# EAGLE design main_board (EAGLE 8.3.0)
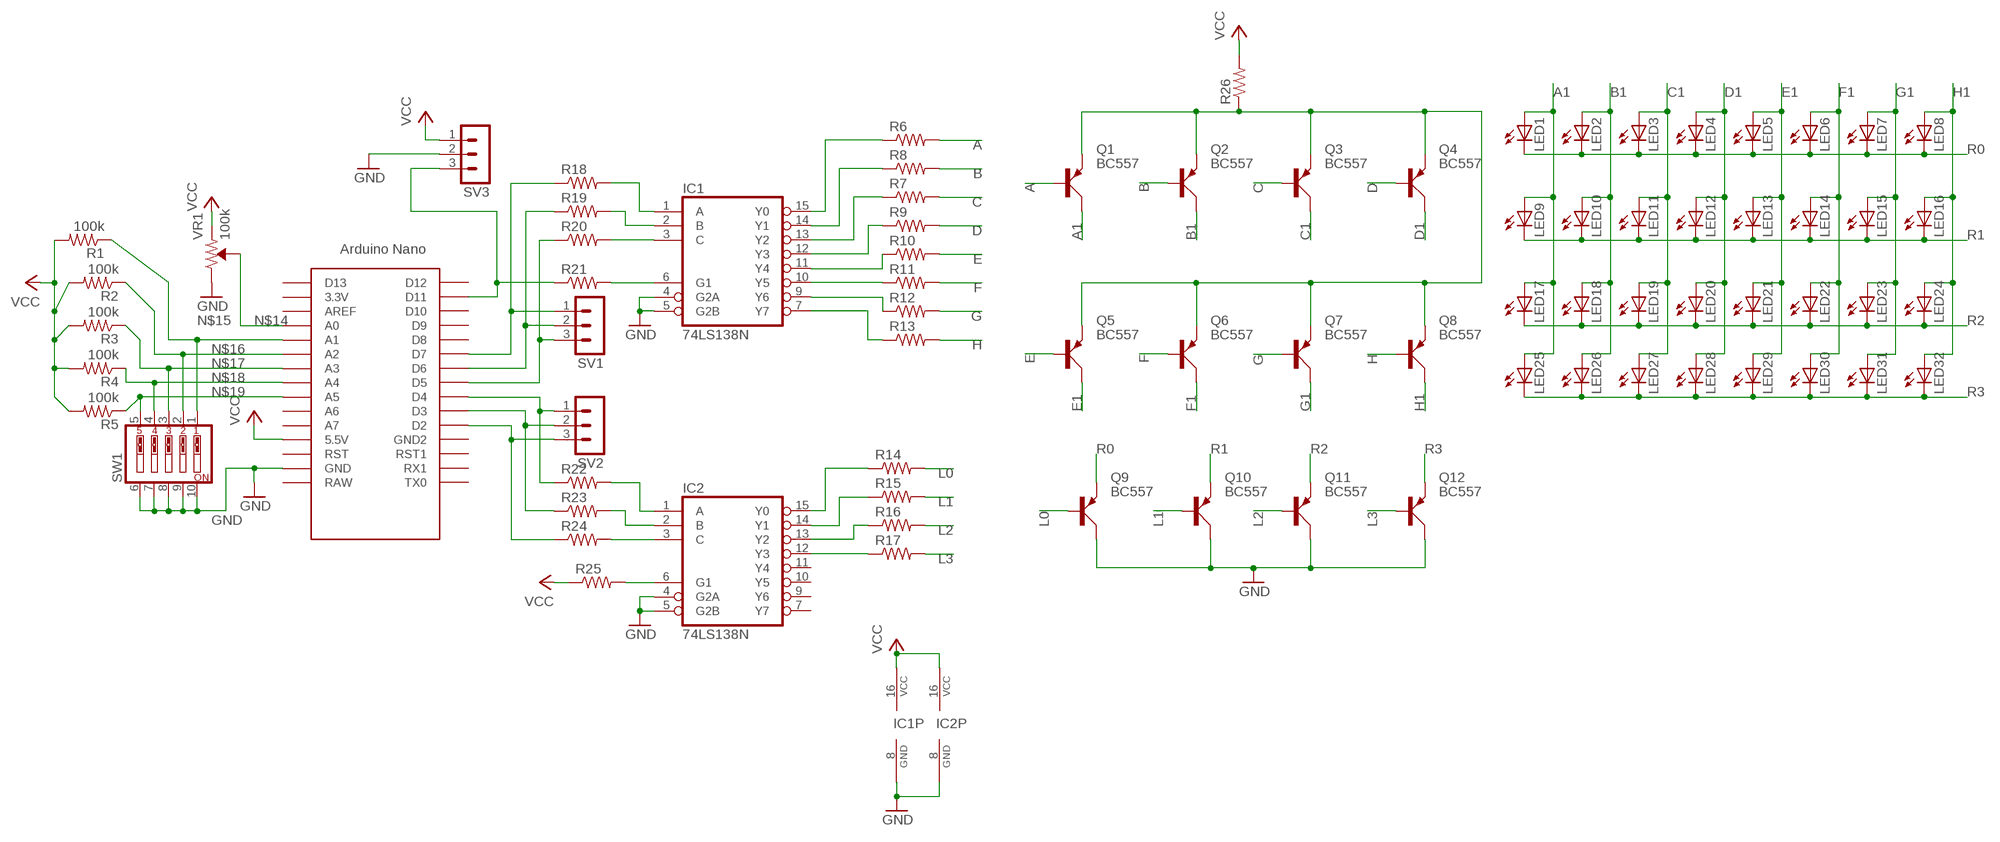
[diagram p0: schematic, sheet 1]

## Parts
ARD1  NANO  [NANO]
IC1  74LS138N  [DIL16]
IC2  74LS138N  [DIL16]
LED1  LED5MM  [LED5MM]
LED2  LED5MM  [LED5MM]
LED3  LED5MM  [LED5MM]
LED4  LED5MM  [LED5MM]
LED5  LED5MM  [LED5MM]
LED6  LED5MM  [LED5MM]
LED7  LED5MM  [LED5MM]
LED8  LED5MM  [LED5MM]
LED9  LED5MM  [LED5MM]
LED10  LED5MM  [LED5MM]
LED11  LED5MM  [LED5MM]
LED12  LED5MM  [LED5MM]
LED13  LED5MM  [LED5MM]
LED14  LED5MM  [LED5MM]
LED15  LED5MM  [LED5MM]
LED16  LED5MM  [LED5MM]
LED17  LED5MM  [LED5MM]
LED18  LED5MM  [LED5MM]
LED19  LED5MM  [LED5MM]
LED20  LED5MM  [LED5MM]
LED21  LED5MM  [LED5MM]
LED22  LED5MM  [LED5MM]
LED23  LED5MM  [LED5MM]
LED24  LED5MM  [LED5MM]
LED25  LED5MM  [LED5MM]
LED26  LED5MM  [LED5MM]
LED27  LED5MM  [LED5MM]
LED28  LED5MM  [LED5MM]
LED29  LED5MM  [LED5MM]
LED30  LED5MM  [LED5MM]
LED31  LED5MM  [LED5MM]
LED32  LED5MM  [LED5MM]
Q1  BC557  [SOT54A]
Q2  BC557  [SOT54A]
Q3  BC557  [SOT54A]
Q4  BC557  [SOT54A]
Q5  BC557  [SOT54A]
Q6  BC557  [SOT54A]
Q7  BC557  [SOT54A]
Q8  BC557  [SOT54A]
Q9  BC557  [SOT54A]
Q10  BC557  [SOT54A]
Q11  BC557  [SOT54A]
Q12  BC557  [SOT54A]
R1  100k  R-US_M0805  [M0805]
R2  100k  R-US_M0805  [M0805]
R3  100k  R-US_M0805  [M0805]
R4  100k  R-US_M0805  [M0805]
R5  100k  R-US_M0805  [M0805]
R6  R-US_R0805  [R0805]
R7  R-US_R0805  [R0805]
R8  R-US_R0805  [R0805]
R9  R-US_R0805  [R0805]
R10  R-US_R0805  [R0805]
R11  R-US_R0805  [R0805]
R12  R-US_R0805  [R0805]
R13  R-US_R0805  [R0805]
R14  R-US_R0805  [R0805]
R15  R-US_R0805  [R0805]
R16  R-US_R0805  [R0805]
R17  R-US_R0805  [R0805]
R18  R-US_M0805  [M0805]
R19  R-US_M0805  [M0805]
R20  R-US_M0805  [M0805]
R21  R-US_M0805  [M0805]
R22  R-US_M0805  [M0805]
R23  R-US_M0805  [M0805]
R24  R-US_M0805  [M0805]
R25  R-US_M0805  [M0805]
R26  R-US_R0805  [R0805]
SV1  MA03-1  [MA03-1]
SV2  MA03-1  [MA03-1]
SV3  MA03-1  [MA03-1]
SW1  SW_DIP-5  [EDG-05]
VR1  100k  TRIMPOT-PTH-10MM-KNOB-1/2W-10%  [TRIMPOT-PTH-3386U]

## Nets
A: Q1.B R6.2
A1: LED1.A LED9.A LED17.A LED25.A Q1.C
B: Q2.B R8.2
B1: LED2.A LED10.A LED18.A LED26.A Q2.C
C: Q3.B R7.2
C1: LED3.A LED11.A LED19.A LED27.A Q3.C
D: Q4.B R9.2
D1: LED4.A LED12.A LED20.A LED28.A Q4.C
E: Q5.B R10.2
E1: LED5.A LED13.A LED21.A LED29.A Q5.C
F: Q6.B R11.2
F1: LED6.A LED14.A LED22.A LED30.A Q6.C
G: Q7.B R12.2
G1: LED7.A LED15.A LED23.A LED31.A Q7.C
GND: ARD1.GND IC1.4(G2A) IC1.5(G2B) IC1.8(GND) IC2.4(G2A) IC2.5(G2B) IC2.8(GND) Q9.C Q10.C Q11.C Q12.C SV3.2 SW1.6 SW1.7 SW1.8 SW1.9 SW1.10 VR1.3(CW)
H: Q8.B R13.2
H1: LED8.A LED16.A LED24.A LED32.A Q8.C
L0: Q9.B R14.2
L1: Q10.B R15.2
L2: Q11.B R16.2
L3: Q12.B R17.2
N$1: IC2.12(Y3) R17.1
N$2: IC1.15(Y0) R6.1
N$4: IC1.14(Y1) R8.1
N$5: IC2.13(Y2) R16.1
N$6: IC1.13(Y2) R7.1
N$7: IC1.12(Y3) R9.1
N$8: IC1.11(Y4) R10.1
N$9: IC1.10(Y5) R11.1
N$10: IC1.9(Y6) R12.1
N$11: IC1.7(Y7) R13.1
N$12: IC2.14(Y1) R15.1
N$13: IC2.15(Y0) R14.1
N$14: ARD1.A0 VR1.2(WIPER)
N$15: ARD1.A1 R1.1 SW1.1
N$16: ARD1.A2 R2.1 SW1.2
N$17: ARD1.A3 R3.1 SW1.3
N$18: ARD1.A4 R4.1 SW1.4
N$19: ARD1.A5 R5.1 SW1.5
N$20: Q1.E Q2.E Q3.E Q4.E Q5.E Q6.E Q7.E Q8.E R26.1
N$22: ARD1.D2 R24.1 SV2.3
N$23: ARD1.D3 R23.1 SV2.2
N$24: ARD1.D4 R22.1 SV2.1
N$25: ARD1.D5 R20.1 SV1.3
N$26: ARD1.D6 R19.1 SV1.2
N$27: ARD1.D7 R18.1 SV1.1
N$31: ARD1.D11 R21.1 SV3.3
N$38: IC2.3(C) R24.2
N$39: IC2.2(B) R23.2
N$40: IC2.1(A) R22.2
N$41: IC1.3(C) R20.2
N$42: IC1.2(B) R19.2
N$43: IC1.1(A) R18.2
N$45: IC1.6(G1) R21.2
N$48: IC2.6(G1) R25.2
R0: LED1.K(C) LED2.K(C) LED3.K(C) LED4.K(C) LED5.K(C) LED6.K(C) LED7.K(C) LED8.K(C) Q9.E
R1: LED9.K(C) LED10.K(C) LED11.K(C) LED12.K(C) LED13.K(C) LED14.K(C) LED15.K(C) LED16.K(C) Q10.E
R2: LED17.K(C) LED18.K(C) LED19.K(C) LED20.K(C) LED21.K(C) LED22.K(C) LED23.K(C) LED24.K(C) Q11.E
R3: LED25.K(C) LED26.K(C) LED27.K(C) LED28.K(C) LED29.K(C) LED30.K(C) LED31.K(C) LED32.K(C) Q12.E
VCC: ARD1.5V(5.5V) IC1.16(VCC) IC2.16(VCC) R1.2 R2.2 R3.2 R4.2 R5.2 R25.1 R26.2 SV3.1 VR1.1(CCW)
Unconnected: ARD1.3.3V ARD1.A6 ARD1.A7 ARD1.AREF ARD1.D8 ARD1.D9 ARD1.D10 ARD1.D12 ARD1.D13 ARD1.GND1(GND2) ARD1.ICSP1 ARD1.ICSP2 ARD1.ICSP3 ARD1.ICSP4 ARD1.ICSP5 ARD1.ICSP6 ARD1.RAW ARD1.RST ARD1.RST1 ARD1.RX1 ARD1.TX0 IC2.7(Y7) IC2.9(Y6) IC2.10(Y5) IC2.11(Y4)

## Library data of the parts
ARD1 = Arduino-clone:NANO: Arduino Nano
IC1 IC2 = 74xx-us:74*138: 3-line to 8-line DECODER/DEMULTIPLEXER
LED1-LED32 = led:LED: LED OSRAM: - CHIPLED LG R971, LG N971, LY N971, LG Q971, LY Q971, LO R971, LY R971 LH N974, LH R974 LS Q976, LO Q976, LY Q976 LO Q996 - Hyper CHIPLED LW Q18S LB Q993, LB Q99A, LB R99A - SideLED LS A670, LO A670, LY A670, LG A670, LP A670 LB A673, LV A673, LT A673, LW A673 LH A674 LY A675 LS A676, LA A676, LO A676, LY A676, LW A676 LS A679, LY A679, LG A679 - Hyper Micro SIDELED® LS Y876, LA Y876, LO Y876, LY Y876 LT Y87S - SmartLED LW L88C, LW L88S LB L89C, LB L89S, LG L890 LS L89K, LO L89K, LY L89K LS L896, LA L896, LO L896, LY L896 - TOPLED LS T670, LO T670, LY T670, LG T670, LP T670 LSG T670, LSP T670, LSY T670, LOP T670, LYG T670 LG T671, LOG T671, LSG T671 LB T673, LV T673, LT T673, LW T673 LH T674 LS T676, LA T676, LO T676, LY T676, LB T676, LH T676, LSB T676, LW T676 LB T67C, LV T67C, LT T67C, LS T67K, LO T67K, LY T67K, LW E67C LS E67B, LA E67B, LO E67B, LY E67B, LB E67C, LV E67C, LT E67C LW T67C LS T679, LY T679, LG T679 LS T770, LO T770, LY T770, LG T770, LP T770 LB T773, LV T773, LT T773, LW T773 LH T774 LS E675, LA E675, LY E675, LS T675 LS T776, LA T776, LO T776, LY T776, LB T776 LHGB T686 LT T68C, LB T68C - Hyper Mini TOPLED® LB M676 - Mini TOPLED Santana® LG M470 LS M47K, LO M47K, LY M47K Source: http://www.osram.convergy.de LUXEON: - LUMILED® LXK2-PW12-R00, LXK2-PW12-S00, LXK2-PW14-U00, LXK2-PW14-V00 LXK2-PM12-R00, LXK2-PM12-S00, LXK2-PM14-U00 LXK2-PE12-Q00, LXK2-PE12-R00, LXK2-PE12-S00, LXK2-PE14-T00, LXK2-PE14-U00 LXK2-PB12-K00, LXK2-PB12-L00, LXK2-PB12-M00, LXK2-PB14-N00, LXK2-PB14-P00, LXK2-PB14-Q00 LXK2-PR12-L00, LXK2-PR12-M00, LXK2-PR14-Q00, LXK2-PR14-R00 LXK2-PD12-Q00, LXK2-PD12-R00, LXK2-PD12-S00 LXK2-PH12-R00, LXK2-PH12-S00 LXK2-PL12-P00, LXK2-PL12-Q00, LXK2-PL12-R00 Source: www.luxeon.com KINGBRIGHT: KA-3528ASYC Source: www.kingbright.com
Q1-Q12 = transistor-small-signal:BC557: PNP TRANSISTOR
R1-R5 R18-R25 = resistor:R-US_: RESISTOR, American symbol
R6-R17 R26 = rcl:R-US_: RESISTOR, American symbol
SV1-SV3 = con-lstb:MA03-1: PIN HEADER; OC_FARNELL: unknown; OC_NEWARK: unknown
SW1 = special:SW_DIP-5: DIP SWITCH
VR1 = SparkFun-Resistors:TRIMPOT: Trimming Potentiometer (Trimpot) Three-terminal potentiometers, with an adjustable wiper and two adjustable resistors. A pot can be used to create a configurable voltage divider, or as a variable resistor. "Trimpots" are a subset of potentiometers, usually intended for "set-and-forget" applications. They're often more delicate than standard potentiometers - rated for fewer turns. Variants PTH-KNOB - PTH Trimpot w/ finger-adjustable knob Trimpot 10K with Knob <https://www.sparkfun.com/products/9806> (COM-09806) Datasheet <http://www.sparkfun.com/datasheets/Components/General/TSR-3386.pdf> SMD-3MM-CLOSED-FRAME - SMD 3mm Square Closed-Frame Trimpot Used on e.g. EasyDriver - Stepper Motor Driver <https://www.sparkfun.com/products/12779> Datasheet <http://www.bitechnologies.com/pdfs/22.pdf> (22AR10KTR) SMD-5MM - SMD 5mm Square Closed-Frame Trimpot Used on e.g. IOIO-OTG - V2.2 <https://www.sparkfun.com/products/13613> Datasheet <http://www.vishay.com/docs/51008/ts53.pdf> (TS53YL502MR10) SMD-3MM-1/10W-25% - 3mm Square Open-Frame Trimpot Used on e.g. SparkFun Shapeoko <https://www.sparkfun.com/products/13899> Datasheet <http://www.bourns.com/docs/Product-Datasheets/TC33.pdf> (TC33X-2-103E); PROD_ID: RES-09730; SF_SKU: COM-09806; VALUE: 10k

## Board
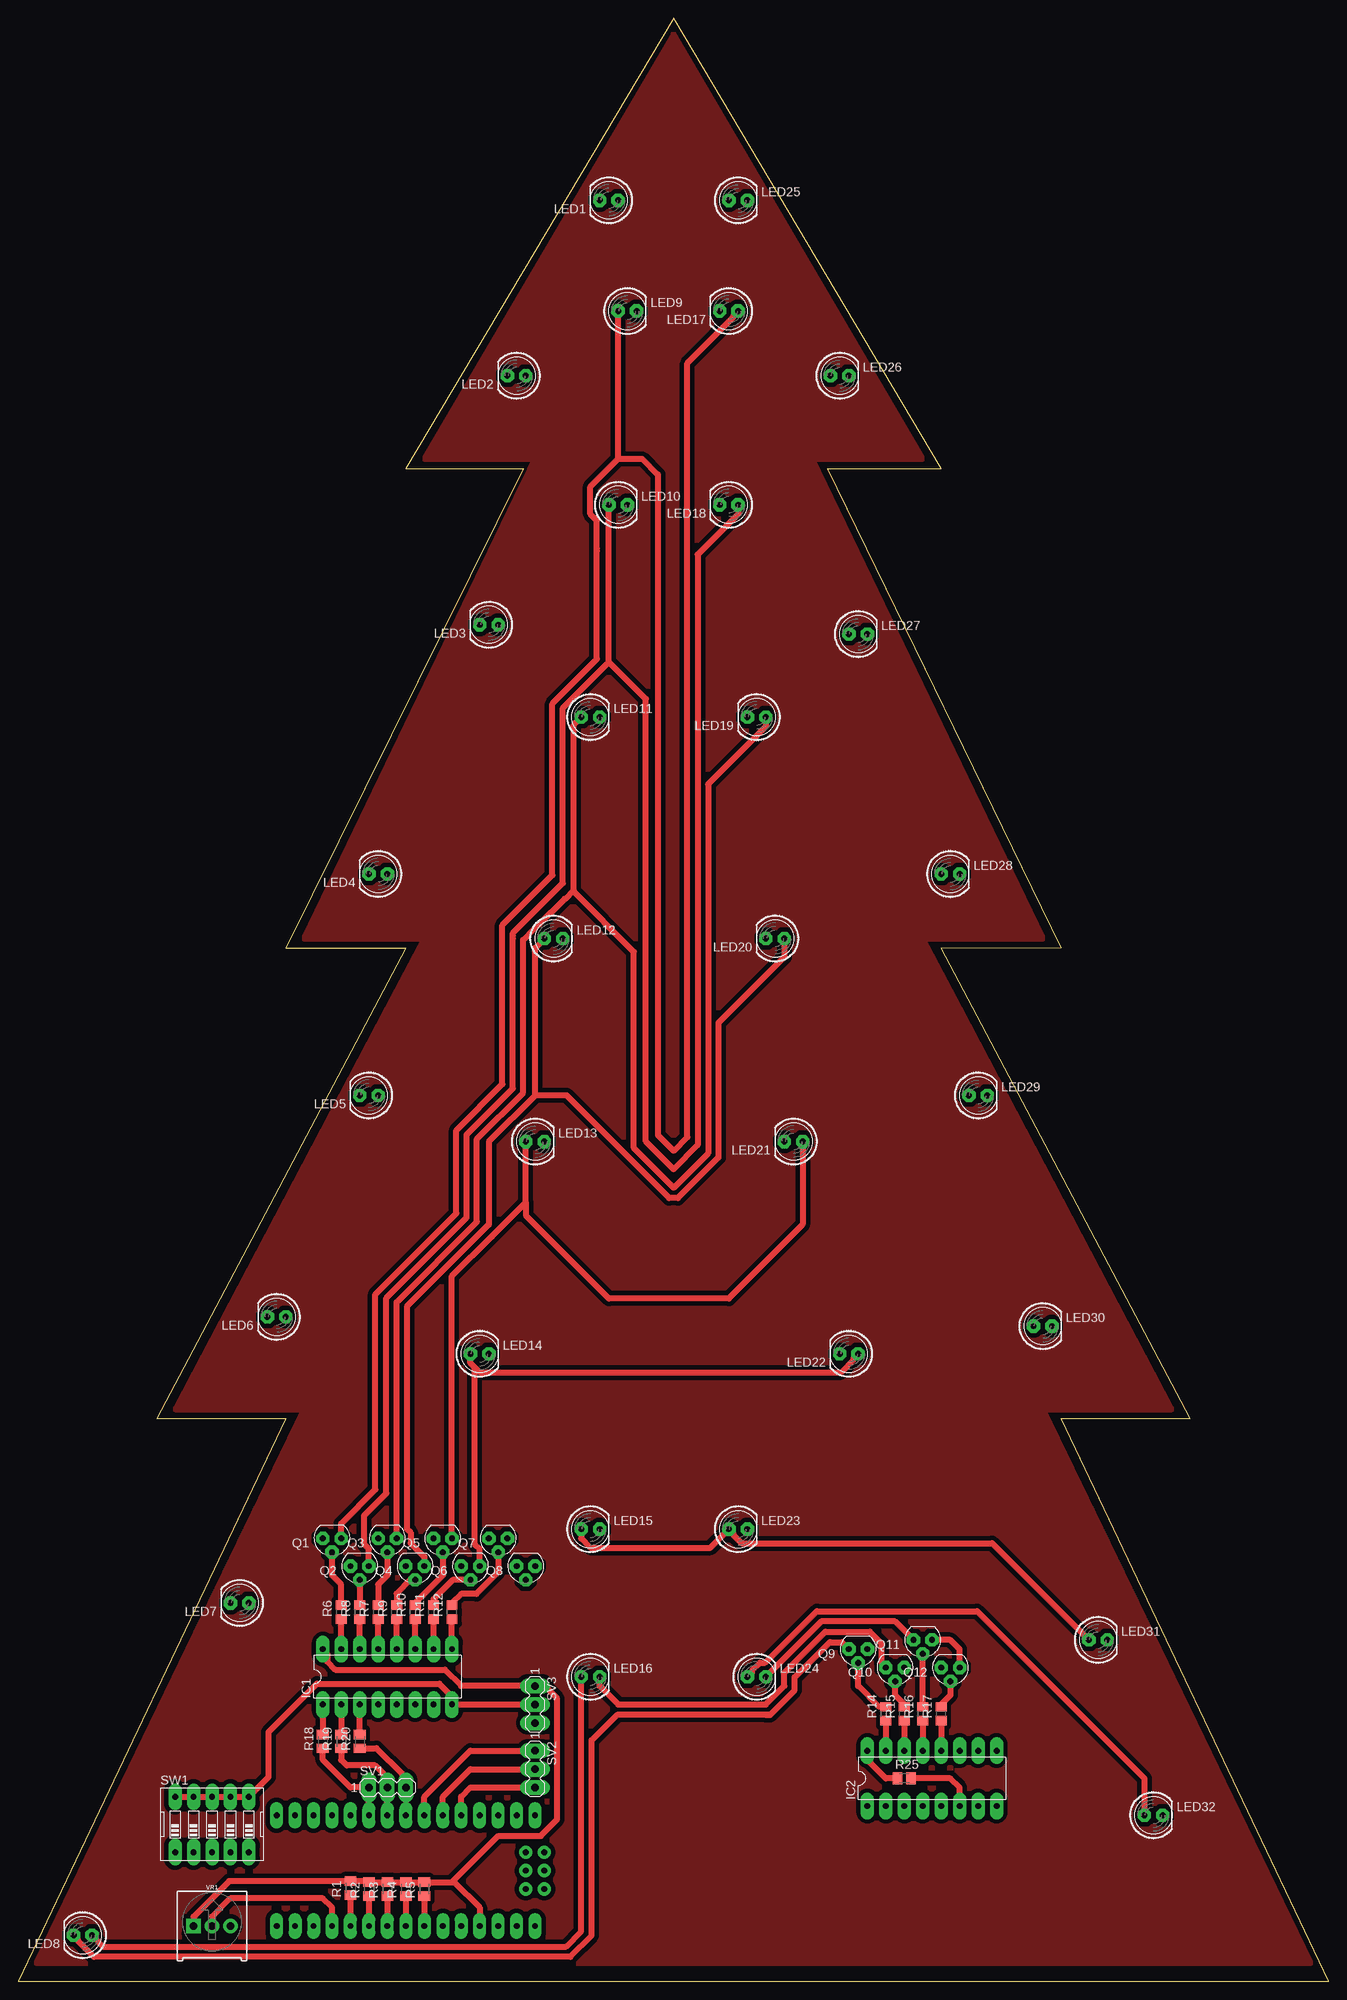
[diagram p1: board, top side]
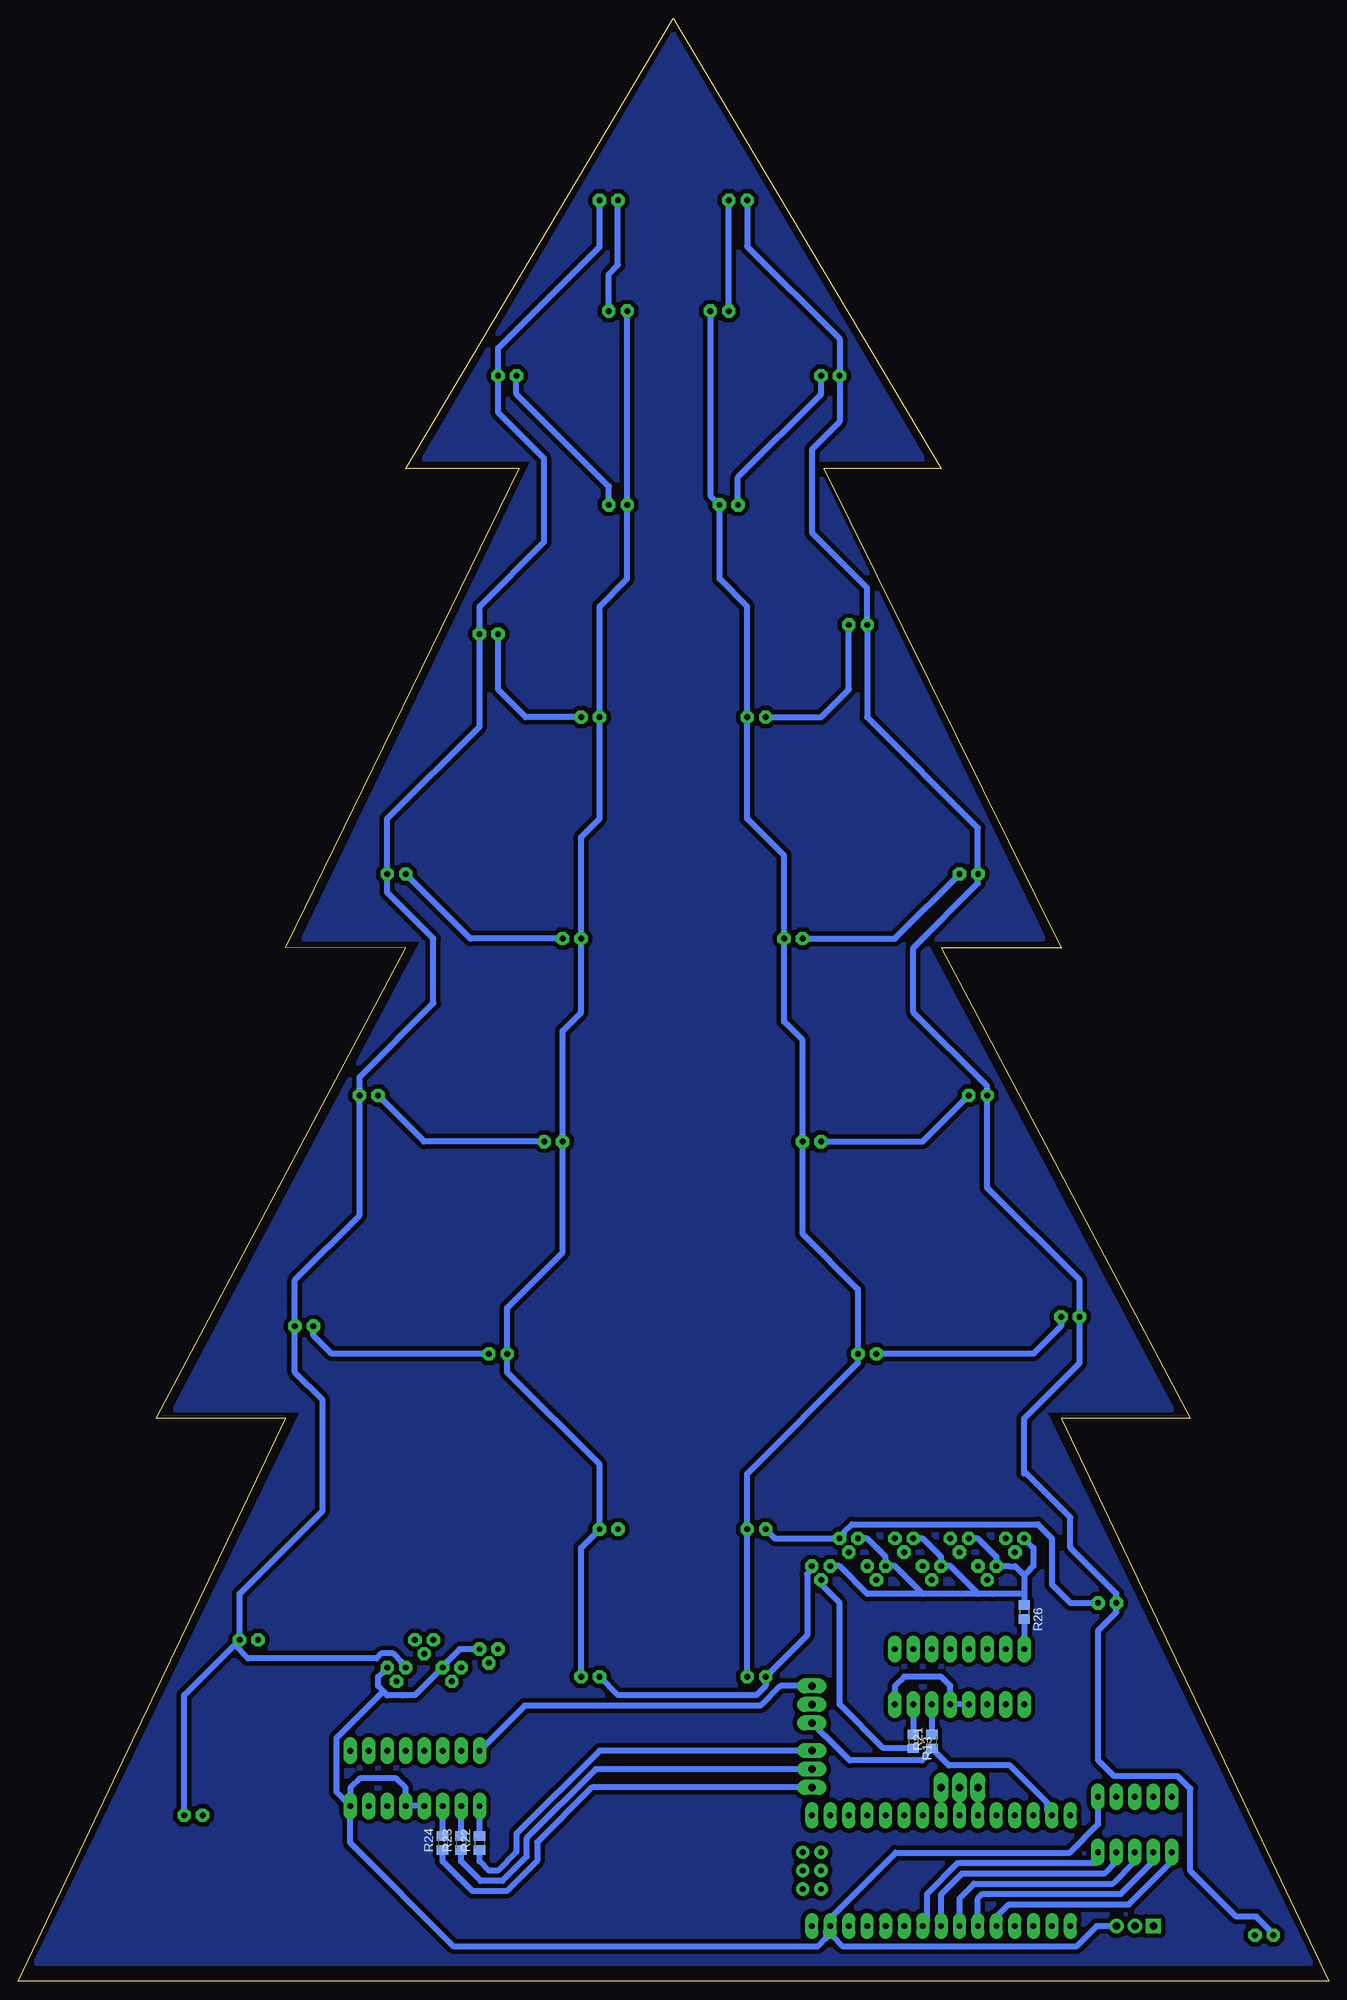
[diagram p2: board, bottom side, seen from below]

Size 180.32 x 270.18 mm. Coordinates in mm from the lower left corner, seen from the top.
Outline: 0,0 180.32,0 143.51,77.47 161.29,77.47 127,142.24 143.49,142.26 111.36,208.2 127,208.15 90.22,270.18 53.34,208.2 69.47,208.15 36.83,142.24 53.34,142.24 19.05,77.47 36.83,77.47 0,0
Copper layers (1*16): Top 0.035mm / dielectric 1.5mm / Bottom 0.035mm
Design rules "LabE *": minimum track width 24mil, minimum drill 1mm, track to track 24mil, track to pad 24mil, pad to pad 16mil, via to via 16mil, smd to smd 8mil, copper to edge 20mil, drill to drill 8mil, minimum pad ring 20mil, minimum via ring 8mil, stop-mask expansion 4mil, vias tented up to drill 0mil, thermal gap 10mil

### Footprints (pad centres in the part's own frame; a part is rotated, then mirrored left to right if it is on the bottom)
NANO = drill 0.8 long: 3.3V -10.16,24.13; 5V -10.16,-1.27; A0 -10.16,19.05; A1 -10.16,16.51; A2 -10.16,13.97; A3 -10.16,11.43; A4 -10.16,8.89; A5 -10.16,6.35; A6 -10.16,3.81; A7 -10.16,1.27; AREF -10.16,21.59; D2 5.08,1.27; D3 5.08,3.81; D4 5.08,6.35; D5 5.08,8.89; D6 5.08,11.43; D7 5.08,13.97; D8 5.08,16.51; D9 5.08,19.05; D10 5.08,21.59; D11 5.08,24.13; D12 5.08,26.67; D13 -10.16,26.67; GND -10.16,-6.35; GND1 5.08,-1.27; RAW -10.16,-8.89; RST -10.16,-3.81; RST1 5.08,-3.81; RX1 5.08,-6.35; TX0 5.08,-8.89 | drill 0.8: ICSP1 -5.08,-10.16; ICSP2 -5.08,-7.62; ICSP3 -2.54,-10.16; ICSP4 -2.54,-7.62; ICSP5 0,-10.16; ICSP6 0,-7.62
DIL16 = drill 0.813 long: 1 -8.89,-3.81; 2 -6.35,-3.81; 3 -3.81,-3.81; 4 -1.27,-3.81; 5 1.27,-3.81; 6 3.81,-3.81; 7 6.35,-3.81; 8 8.89,-3.81; 9 8.89,3.81; 10 6.35,3.81; 11 3.81,3.81; 12 1.27,3.81; 13 -1.27,3.81; 14 -3.81,3.81; 15 -6.35,3.81; 16 -8.89,3.81
LED5MM = drill 0.813 octagon: A -1.27,0; K 1.27,0
SOT54A = drill 0.813 octagon: B 0,1.905; C -1.27,0; E 1.27,0
M0805 = smd 1.3 x 1.6: 1 -0.95,0; 2 0.95,0
R0805 = smd 1.3 x 1.5: 1 -0.95,0; 2 0.95,0
MA03-1 = drill 1.016 long: 1 -2.54,0; 2 0,0; 3 2.54,0
EDG-05 = drill 0.813 long: 1 -5.08,-3.81; 2 -2.54,-3.81; 3 0,-3.81; 4 2.54,-3.81; 5 5.08,-3.81; 6 5.08,3.81; 7 2.54,3.81; 8 0,3.81; 9 -2.54,3.81; 10 -5.08,3.81
TRIMPOT-PTH-3386U = drill 1.016 pad 1.88 square: 1 -2.54,-0.015 | drill 1.016 pad 1.88: 2 0,-0.015; 3 2.54,-0.015

### Placement (x,y rotation side)
ARD1  62.23,17.78 90 top
IC1  50.8,41.91 0 top
IC2  125.73,27.94 0 top
LED1  81.28,245.11 180 top
LED2  68.58,220.98 180 top
LED3  64.77,186.69 180 top
LED4  49.53,152.4 180 top
LED5  48.26,121.92 180 top
LED6  35.56,91.44 180 top
LED7  30.48,52.07 180 top
LED8  8.89,6.35 180 top
LED9  83.82,229.87 0 top
LED10  82.55,203.2 0 top
LED11  78.74,173.99 0 top
LED12  73.66,143.51 0 top
LED13  71.12,115.57 0 top
LED14  63.5,86.36 0 top
LED15  78.74,62.23 0 top
LED16  78.74,41.91 0 top
LED17  97.79,229.87 180 top
LED18  97.79,203.2 180 top
LED19  101.6,173.99 180 top
LED20  104.14,143.51 180 top
LED21  106.68,115.57 180 top
LED22  114.3,86.36 180 top
LED23  99.06,62.23 0 top
LED24  101.6,41.91 0 top
LED25  99.06,245.11 0 top
LED26  113.03,220.98 0 top
LED27  115.57,185.42 0 top
LED28  128.27,152.4 0 top
LED29  132.08,121.92 0 top
LED30  140.97,90.17 0 top
LED31  148.59,46.99 0 top
LED32  156.21,22.86 0 top
Q1  43.18,60.96 180 top
Q2  46.99,57.15 180 top
Q3  50.8,60.96 180 top
Q4  54.61,57.15 180 top
Q5  58.42,60.96 180 top
Q6  62.23,57.15 180 top
Q7  66.04,60.96 180 top
Q8  69.85,57.15 180 top
Q9  115.57,45.72 180 top
Q10  120.65,43.18 180 top
Q11  124.46,46.99 180 top
Q12  128.27,43.18 180 top
R1  45.72,12.83 90 top
R2  48.26,12.7 90 top
R3  50.8,12.7 90 top
R4  53.34,12.7 90 top
R5  55.88,12.7 90 top
R6  44.45,50.8 90 top
R7  49.53,50.8 90 top
R8  46.99,50.8 90 top
R9  52.07,50.8 90 top
R10  54.61,50.8 90 top
R11  57.15,50.8 90 top
R12  59.69,50.8 90 top
R13  57.15,33.02 270 bottom
R14  119.38,36.83 90 top
R15  121.92,36.83 90 top
R16  124.46,36.83 90 top
R17  127,36.83 90 top
R18  41.91,33.02 90 top
R19  44.45,33.02 90 top
R20  46.99,33.02 90 top
R21  54.61,33.02 90 bottom
R22  116.84,19.05 90 bottom
R23  119.38,19.05 90 bottom
R24  121.92,19.05 90 bottom
R25  121.92,27.94 0 top
R26  41.91,50.8 270 bottom
SV1  50.8,26.67 0 top
SV2  71.12,29.21 270 top
SV3  71.12,38.1 270 top
SW1  26.67,21.59 0 top
VR1  26.67,7.62 0 top

### Tracks (layer width: path | path; a pad name or v marks a point on that pad's centre or on a via)
A
  Top 0.813: R6.2 44.45,54.61 43.18,55.88 Q1.B
A1
  Top 0.813: Q1.C 44.45,62.97 49.16,67.68 49.16,94.56 60.28,105.69 60.28,117.12 66.63,123.47 66.63,145.37 73.51,152.25 73.51,175.85 79.64,181.98 79.64,196.85 | 79.64,196.85 79.64,197.22 | 82.55,209.55 78.74,205.74 78.74,201.93 79.64,201.03 79.64,196.85 | 82.55,209.55 LED9.A | 82.55,209.55 85.85,209.55 88.01,207.39 88.01,116.46 90.17,114.3 92.08,116.2 92.08,222.69 98.45,229.07 98.45,229.26 LED17.A
  Bottom 0.813: LED17.A 99.06,234.95 97.79,236.22 LED25.A | LED9.A LED1.A
B
  Top 0.813: Q2.B 46.99,52.07 | 46.99,51.52 46.99,52.07 | 46.99,52.07 46.99,51.52 | R8.2 46.99,51.52
B1
  Top 0.813: Q2.C 48.26,59.5 47.6,60.16 47.6,64.11 50.65,67.16 50.65,94.04 61.71,105.1 61.71,116.53 68.06,122.88 68.06,143.51 | 68.06,143.51 68.06,143.92 | LED10.A 81.28,181.61 81.26,181.59 | 81.26,181.59 74.93,175.26 74.93,151.13 68.06,144.26 68.06,143.51 | LED18.A 99.06,201.93 93.5,196.37 93.5,115.09 90.17,111.76 86.36,115.57 86.36,176.49 81.26,181.59
  Bottom 0.813: LED18.A 99.06,205.74 111.76,218.44 LED26.A | LED10.A 81.28,207.01 69.85,218.44 LED2.A
C
  Top 0.813: Q3.B 50.8,55.88 49.53,54.61 R7.2
C1
  Top 0.813: Q3.C 52.07,93.45 63.13,104.51 63.13,115.94 69.48,122.29 69.48,143.33 71.03,144.88 | 71.03,144.88 71.59,145.44 | LED19.A 102.87,172.72 94.92,164.77 94.92,113.97 90.17,109.22 84.71,114.68 84.71,141.68 76.36,150.02 | 71.03,144.88 71.59,145.44 | 71.59,145.44 71.65,145.44 75.18,148.97 75.31,148.97 76.36,150.02 | LED11.A 76.45,172.97 76.45,150.11 76.36,150.02
  Bottom 0.813: LED19.A 110.49,173.99 114.3,177.8 LED27.A | LED11.A 69.85,173.99 66.04,177.8 LED3.A
D
  Top 0.813: Q4.B 54.16,55.24 54.14,55.22 53.95,55.22 52.07,53.34 R9.2
D1
  Top 0.813: Q4.C 55.88,58.42 54,60.3 54,61.76 53.49,62.27 53.49,92.86 64.77,104.14 64.77,115.57 71.12,121.92 | 71.12,121.92 71.12,142.24 LED12.A | LED20.A 105.41,140.97 96.34,131.9 96.34,113.38 90.76,107.8 89.58,107.8 75.46,121.92 71.12,121.92
  Bottom 0.813: LED20.A 118.11,143.51 LED28.A | LED12.A 59.69,143.51 LED4.A
E
  Top 0.813: Q5.B 58.42,55.88 54.61,52.07 | 54.61,52.07 54.61,51.73 | 54.61,51.73 54.61,51.52 54.61,51.73 | R10.2 54.61,52.07
E1
  Top 0.813: 69.85,107.16 LED13.A | 69.85,107.16 69.85,105.41 81.28,93.98 97.79,93.98 107.95,104.14 LED21.A | Q5.C 59.69,97.05 65.14,102.5 65.16,102.5 69.22,106.55 69.24,106.55 69.85,107.16
  Bottom 0.813: LED21.A 124.46,115.57 LED29.A | LED13.A 55.88,115.57 LED5.A
F
  Top 0.813: Q6.B 61.78,55.24 61.76,55.22 59.77,55.22 57.52,52.97 57.52,52.95 57.15,52.58 R11.2
F1
  Top 0.813: 62.23,85.09 LED14.A | 62.23,85.09 63.5,83.82 113.22,83.82 114.96,85.56 114.96,85.75 LED22.A | Q6.C 63.5,59.5 62.84,60.16 62.84,84.48 62.23,85.09
  Bottom 0.813: LED6.A 36.83,90.17 40.64,86.36 LED14.A | LED22.A 137.16,86.36 139.7,88.9 LED30.A
G
  Top 0.813: Q7.B 66.04,56.33 63.03,53.31 60.94,53.31 59.69,52.07 R12.2
G1
  Top 0.813: LED15.A 77.47,60.96 78.74,59.69 95.25,59.69 LED23.A 98.4,61.62 98.4,61.43 99.53,60.3 134.01,60.3 LED31.A
  Bottom 0.813: LED15.A 76.2,60.96 Q7.C 66.7,61.57 66.7,61.76 65.57,62.89 40.03,62.89 38.1,60.96 38.1,54.61 35.56,52.07 LED7.A
GND
  Top 0.813: SW1.10 SW1.9 SW1.8 SW1.7 SW1.6 34.47,28.12 34.47,34.3 41.11,40.95 57.95,40.95 59.52,39.37 59.69,39.37 IC1.8 SV3.2 | Q12.C 129.54,45.72 128.27,46.99 Q11.C
  Bottom 0.813: SW1.6 31.75,21.59 35.63,17.71 59.58,17.71 68.58,8.71 ARD1.GND | Q9.C 119.57,45.72 121.31,43.98 121.31,43.79 Q10.C 125.73,39.37 127.44,39.37 127.47,39.34 129.51,39.34 130.18,40.01 | 130.18,40.01 130.81,40.64 130.81,41.91 Q12.C | 130.18,40.01 130.18,39.84 136.55,33.46 136.55,26.06 134.87,24.38 | 134.87,24.38 IC2.8 134.62,19.05 120.36,4.79 70.32,4.79 69.2,5.92 69.2,7 ARD1.GND | VR1.3 31.95,7.61 34.76,4.79 66.84,4.79 68.4,6.35 68.58,6.35 ARD1.GND | IC2.4 IC2.5 127,26.67 128.27,27.94 133.35,27.94 134.62,26.67 134.62,24.64 134.87,24.38 | IC1.4 IC1.5 52.07,40.64 53.34,41.91 58.42,41.91 59.69,40.64 IC1.8
H
  Bottom 0.813: R13.2 61.28,32.07 67.31,38.1 67.31,52.07 69.85,54.61 Q8.B
H1
  Top 0.813: LED16.A 77.47,6.88 75.38,4.79 11.72,4.79 LED8.A | 100.33,42.1 LED24.A 100.94,42.52 100.94,42.71 102.07,43.84 102.79,43.84 109.9,50.95 131.93,50.95 154.94,27.94 LED32.A
  Bottom 0.813: Q8.C 71.12,56.7 71.78,56.05 71.78,47.6 LED16.A 77.47,40.64 78.74,39.37 97.79,39.37 LED24.A
L0
  Top 0.813: R14.2 118.43,37.78 115.57,40.64 Q9.B
L1
  Top 0.813: R15.2 121.92,38.1 120.65,39.37 Q10.B
L2
  Top 0.813: R16.2 Q11.B
L3
  Top 0.813: Q12.B 128.27,39.37 127,38.1 R17.2
N$1
  Top 0.813: R17.1 IC2.12
N$2
  Top 0.813: IC1.15 R6.1
N$3
  pour Top: 90.17,267.97 55.88,209.55 71.12,209.55 39.37,143.51 55.88,143.51 21.59,78.74 39.37,78.74 2.54,2.54 177.8,2.54 140.97,78.74 158.75,78.74 124.46,143.51 140.97,143.51 109.22,209.55 124.46,209.55
  pour Bottom: 90.17,267.97 124.46,209.55 109.22,209.55 140.97,143.51 124.46,143.51 158.75,78.74 140.97,78.74 177.8,2.54 2.54,2.54 39.37,78.74 21.59,78.74 55.88,143.51 39.37,143.51 71.12,209.55 55.88,209.55
N$4
  Top 0.813: IC1.14 R8.1
N$5
  Top 0.813: R16.1 IC2.13
N$6
  Top 0.813: IC1.13 R7.1
N$7
  Top 0.813: IC1.12 R9.1
N$8
  Top 0.813: IC1.11 R10.1
N$9
  Top 0.813: IC1.10 R11.1
N$10
  Top 0.813: IC1.9 R12.1
N$11
  Bottom 0.813: IC1.7 R13.1
N$12
  Top 0.813: R15.1 IC2.14
N$13
  Top 0.813: R14.1 IC2.15
N$14
  Top 0.813: ARD1.A0 43.18,10.16 41.91,11.43 29.21,11.43 26.67,8.89 VR1.2
N$15
  Top 0.813: R1.1 ARD1.A1
  Bottom 0.813: ARD1.A1 45.72,8.89 44.01,10.6 27.5,10.6 21.59,16.51 SW1.1
N$16
  Top 0.813: R2.1 ARD1.A2
  Bottom 0.813: ARD1.A2 48.26,11.43 47.67,12.02 28.62,12.02 24.13,16.51 SW1.2
N$17
  Top 0.813: R3.1 ARD1.A3
  Bottom 0.813: ARD1.A3 50.8,11.43 48.78,13.45 29.73,13.45 26.67,16.51 SW1.3
N$18
  Top 0.813: R4.1 ARD1.A4
  Bottom 0.813: ARD1.A4 53.34,11.96 50.43,14.87 30.85,14.87 29.21,16.51 SW1.4
N$19
  Top 0.813: R5.1 ARD1.A5
  Bottom 0.813: ARD1.A5 55.26,8.24 55.26,12.05 51.02,16.29 31.97,16.29 31.75,16.51 SW1.5
N$20
  Bottom 0.813: Q7.E 63.5,60.96 60.96,58.42 Q6.E 59.69,57.15 55.85,53.31 | Q3.E 48.26,60.96 45.72,58.42 Q2.E 44.01,57.15 43.98,57.12 43.16,57.12 41.91,55.88 | 41.91,55.88 41.91,53.34 | 41.91,53.34 R26.1 | 41.3,56.49 41.91,55.88 | 41.3,56.49 41.01,56.78 | Q1.E 40.64,59.69 40.64,57.15 41.3,56.49 | 41.91,53.34 46.16,53.34 46.19,53.31 48.23,53.31 | 48.23,53.31 52.07,57.15 Q4.E 53.34,58.42 55.88,60.96 Q5.E | 48.23,53.31 55.85,53.31 | 55.85,53.31 63.48,53.31 67.31,57.15 Q8.E
N$22
  Top 0.813: ARD1.D2 60.96,25.4 62.23,26.67 SV2.3
  Bottom 0.813: SV2.3 101.39,26.67 108.92,19.14 108.92,16.6 113.12,12.39 117.81,12.39 121.92,16.51 R24.1
N$23
  Top 0.813: ARD1.D3 58.42,25.4 62.23,29.21 SV2.2
  Bottom 0.813: SV2.2 100.86,29.21 110.34,19.73 110.34,17.19 113.71,13.82 116.69,13.82 119.38,16.51 R23.1
N$24
  Top 0.813: ARD1.D4 55.88,25.4 62.23,31.75 SV2.1
  Bottom 0.813: SV2.1 100.33,31.75 111.76,20.32 111.76,17.78 114.3,15.24 115.57,15.24 116.84,16.51 R22.1
N$25
  Top 0.813: ARD1.D5 SV1.3 53.34,27.94 52.83,28.45 52.83,28.53 49.29,32.07 R20.1
N$26
  Top 0.813: ARD1.D6 SV1.2 50.29,27.18 50.29,28.53 49.1,29.72 45.21,29.72 44.45,30.48 44.45,31.84 | 44.45,31.84 44.45,32.3 | R19.1 44.45,31.84
N$27
  Top 0.813: ARD1.D7 SV1.1 45.72,26.67 41.91,30.48 R18.1
N$31
  Bottom 0.813: SV3.3 69.34,33.78 69.26,33.78 65.88,30.4 55.98,30.4 55.38,31 55.38,31.3 R21.1 52.26,29.72 43.87,29.72 38.72,24.57 38.72,23.48 ARD1.D11
N$38
  Bottom 0.813: R24.2 IC2.3
N$39
  Bottom 0.813: R23.2 IC2.2
N$40
  Bottom 0.813: R22.2 IC2.1
N$41
  Top 0.813: R20.2 IC1.3
N$42
  Top 0.813: IC1.2 R19.2
N$43
  Top 0.813: IC1.1 R18.2
N$45
  Bottom 0.813: IC1.6 R21.2
N$48
  Top 0.813: IC2.6 129.54,26.67 128.27,27.94 R25.2
R0
  Top 0.813: 103.46,36.68 82.4,36.68 78.89,33.17 78.89,6.29 75.97,3.37 10.41,3.37 8.23,5.55 8.23,5.74 LED8.K | 102.87,36.68 103.46,36.68 | 103.46,36.68 106.83,40.05 106.83,41.85 111.67,46.69 | 111.67,46.69 111.76,46.69 | Q9.E 113.33,46.69 111.67,46.69
  Bottom 0.813: 41.91,70.17 41.91,69.85 | 41.91,70.17 41.91,77.47 34.29,85.09 LED6.K 34.29,96.52 46.99,109.22 LED5.K 46.99,123.19 57.15,133.35 57.15,142.24 48.26,151.13 LED4.K 48.26,158.75 63.5,173.99 LED3.K 63.5,191.77 71.12,199.39 71.12,210.82 67.31,214.63 LED2.K 67.31,226.06 80.01,238.76 LED1.K | LED8.K 8.23,6.96 8.23,7.15 9.97,8.89 12.7,8.89 19.05,15.24 19.05,26.5 20.79,28.25 29.52,28.25 31.75,30.48 31.75,48.26 29.21,50.8 LED7.K 29.21,53.34 35.56,59.69 35.56,63.82 41.91,70.17
R1
  Top 0.813: Q10.E 118.77,43.79 118.77,46.52 117.18,48.11 111.08,48.11 105.41,42.44 105.41,40.64 102.87,38.1 82.55,38.1 80.01,40.64 LED16.K
  Bottom 0.813: LED9.K 85.09,204.47 LED10.K 83.82,193.04 80.01,189.23 LED11.K 80.01,160.02 74.93,154.94 LED12.K 74.93,132.08 72.39,129.54 LED13.K 72.39,102.87 64.77,95.25 LED14.K 64.77,85.09 80.01,69.85 LED15.K LED16.K
R2
  Top 0.813: LED24.K 110.49,49.53 120.65,49.53 Q11.E
  Bottom 0.813: LED24.K 102.87,59.69 LED23.K | LED23.K 100.33,63.5 | LED17.K LED18.K 96.52,193.04 100.33,189.23 LED19.K 100.33,160.02 102.87,157.48 LED20.K 102.87,133.35 105.41,130.81 LED21.K 105.41,100.33 113.03,92.71 LED22.K 113.03,83.82 100.33,71.12 LED23.K
R3
  Bottom 0.813: LED32.K 157.48,39.37 150.55,46.3 | 150.55,46.3 LED31.K 149.86,53.34 138.43,64.77 138.43,80.01 142.24,83.82 LED30.K 142.24,96.52 133.35,105.41 LED29.K 133.35,124.46 123.19,134.62 123.19,143.51 129.54,149.86 LED28.K 129.54,160.02 116.84,172.72 LED27.K 116.84,189.23 107.95,198.12 107.95,209.55 114.3,215.9 LED26.K 114.3,224.79 100.33,238.76 LED25.K | Q12.E 127.61,43.79 127.61,43.98 128.74,45.11 130.34,45.11 131,44.45 148.71,44.45 150.55,46.3
VCC
  Top 0.813: 59.69,13.65 R5.2 R4.2 R3.2 R2.2 48.13,13.78 R1.2 29.02,13.78 24.13,8.89 VR1.1 | 59.69,13.65 60.01,13.65 63.5,10.16 ARD1.5V | R25.1 119.38,27.94 116.84,30.48 IC2.16 | IC1.16 42.52,45.11 42.52,44.01 43.65,42.88 58.73,42.88 60.96,40.64 SV3.1 72.39,40.64 72.9,40.13 72.98,40.13 74.17,38.94 74.17,22.28 71.92,20.03 66.07,20.03 59.69,13.65
  Bottom 0.813: SV3.1 75.46,40.64 78.15,37.95 110.64,37.95 IC2.16 | R26.2 IC1.16